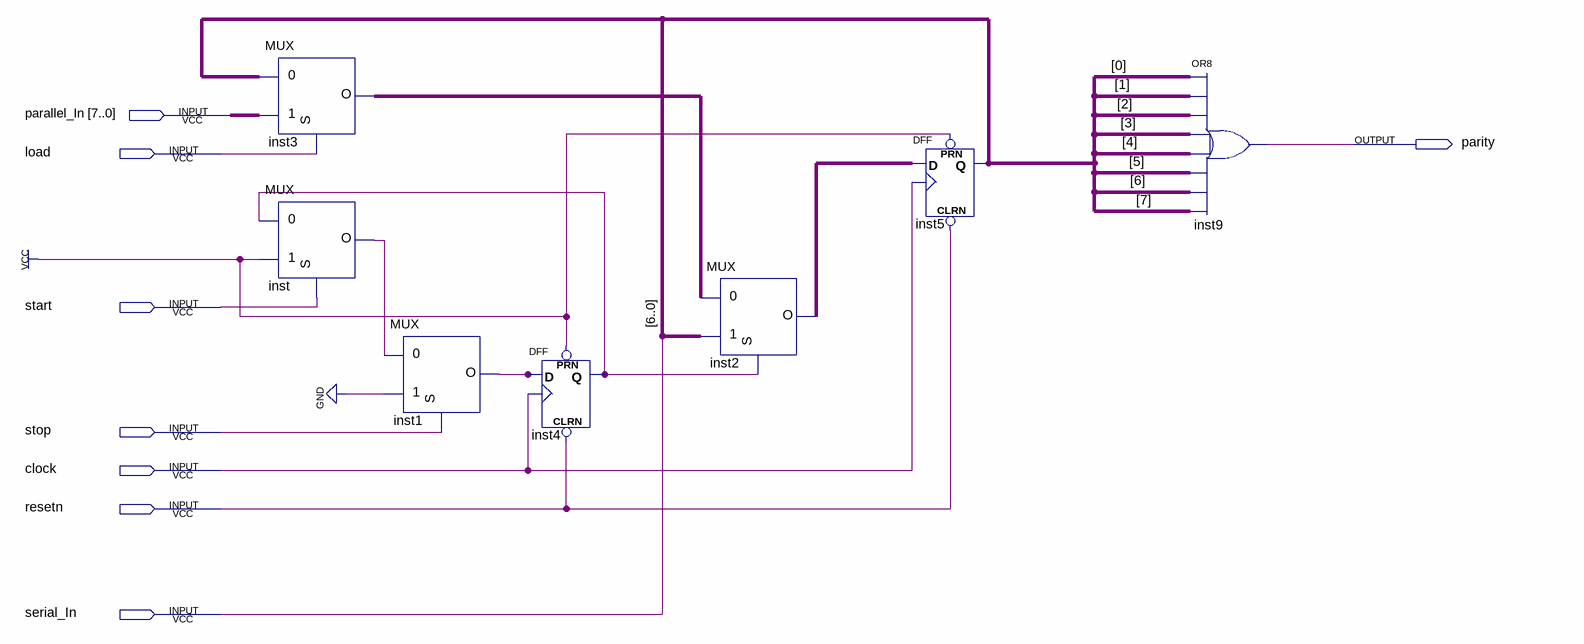
[diagram p0: schematic sheet]
// Quartus schematic Q4.bdf as structural Verilog: 7 symbols, 8 pins
module Q4 (
  input  [7:0] parallel_In,
  input  load,
  input  start,
  input  stop,
  input  clock,
  input  resetn,
  input  serial_In,
  output parity
);

  wire inst1_o, inst2_o, inst3_o, inst4_q, inst5_q, inst_o;

  MUX inst3 (.\0 (inst5_q), .\1 (parallel_In), .S(load), .O(inst3_o));
  MUX inst (.\0 (inst4_q), .\1 (1'b1), .S(start), .O(inst_o));
  MUX inst1 (.\0 (inst_o), .\1 (1'b0), .S(stop), .O(inst1_o));
  DFF inst4 (.CLRN(resetn), .CLK(clock), .D(inst1_o), .PRN(1'b1), .Q(inst4_q));
  MUX inst2 (.\0 (inst3_o), .\1 (inst5_q), .S(inst4_q), .O(inst2_o));
  DFF inst5 (.CLRN(resetn), .CLK(clock), .D(inst2_o), .PRN(1'b1), .Q(inst5_q));
  or inst9 (parity, inst5_q, inst5_q, inst5_q, inst5_q, inst5_q, inst5_q, inst5_q, inst5_q);
endmodule
